# EasyEDA Pro project PathFinder (1).eprj

# Schematic Schematic1
Board Name: Board1; Create Date: 2026-07-12; Page Name: P1; Project Name: PathFinder; Schematic Name: Schematic1; Update Date: 2026-07-12; Company: EasyEDA.com; Page Size: A4; Version: V1.0
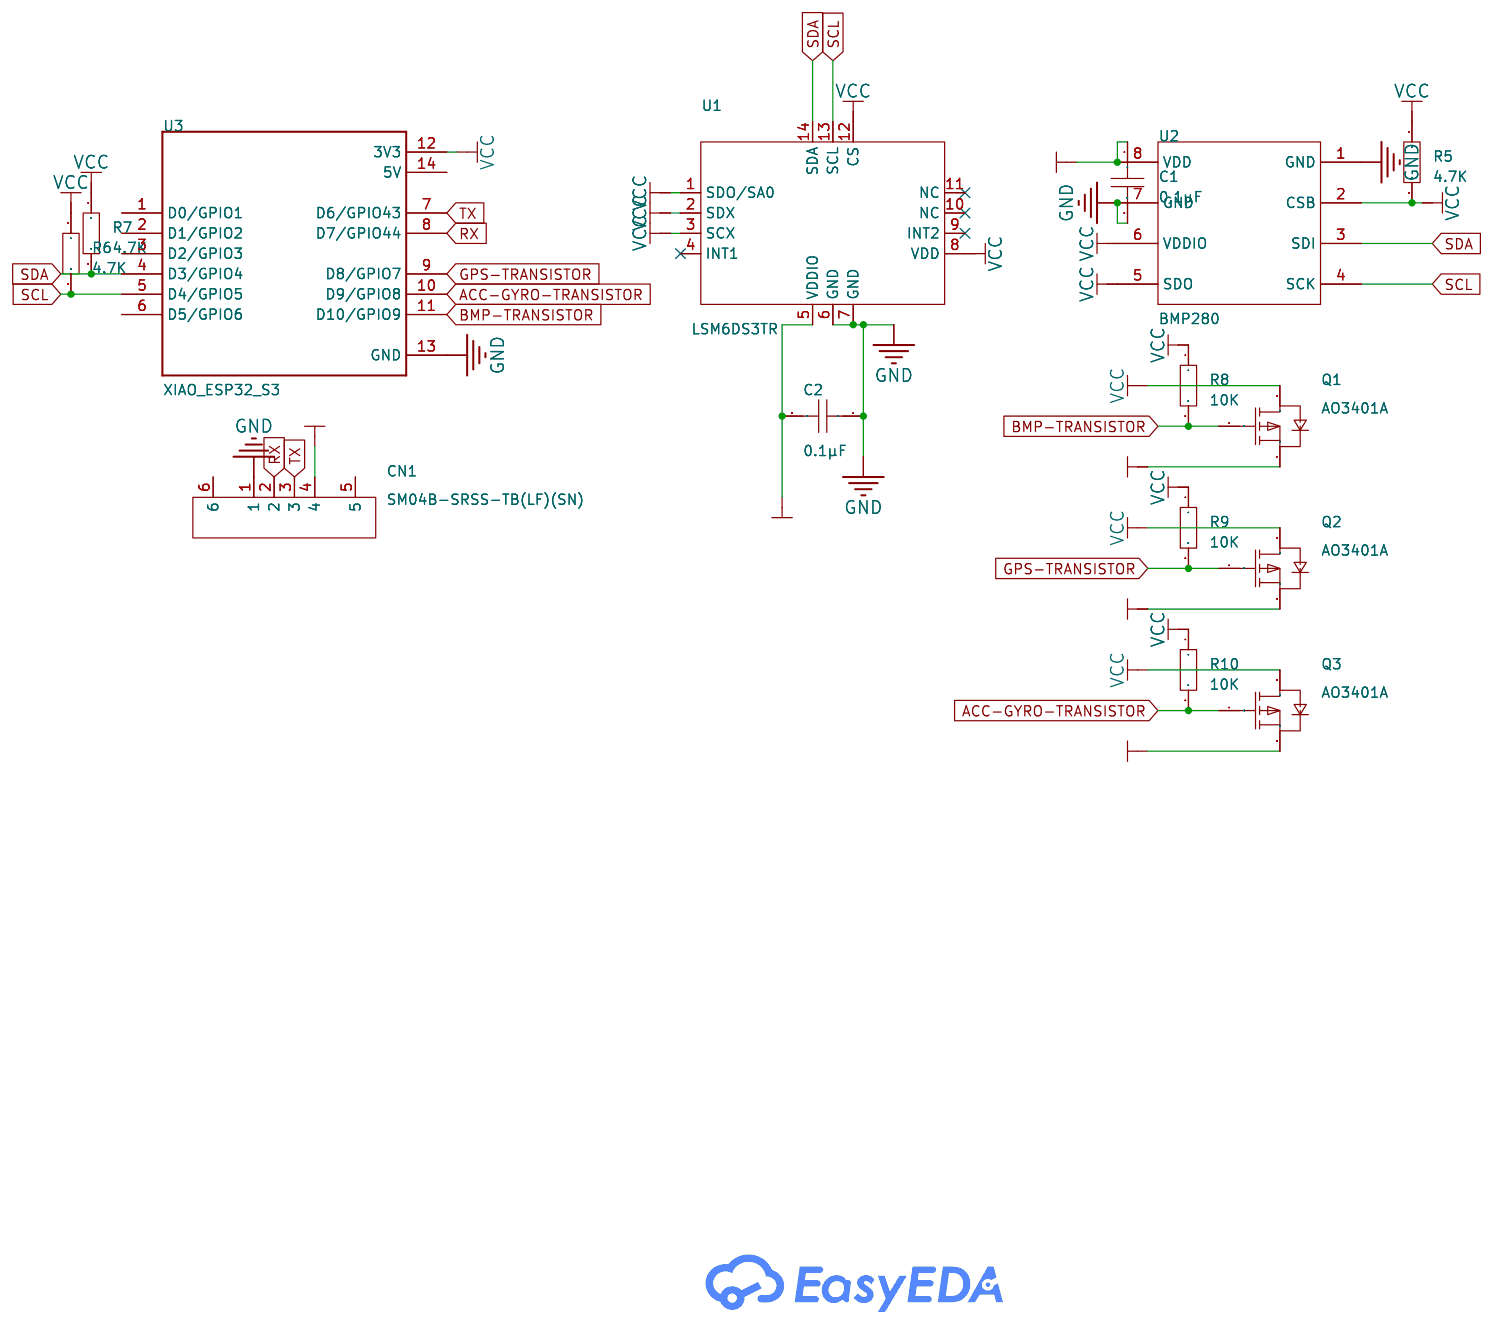
[diagram p0: schematic sheet]

## Parts
C1  100nF  [C0603]
C2  100nF  [C0603]
CN1  SM04B-SRSS-TB(LF)(SN)  [CONN-SMD_4P-P1.00_SM04B-SRSS-TB-LF-SN]
Q1  AO3401A  [SOT-23-3_L2.9-W1.3-P1.90-LS2.4-BR]
Q2  AO3401A  [SOT-23-3_L2.9-W1.3-P1.90-LS2.4-BR]
Q3  AO3401A  [SOT-23-3_L2.9-W1.3-P1.90-LS2.4-BR]
R5  10K  [R0603]
R6  10K  [R0603]
R7  10K  [R0603]
R8  10K  [R0603]
R9  10K  [R0603]
R10  10K  [R0603]
U1  LSM6DS3TR  [LGA-14_L3.0-W2.5-P0.50-TL]
U2  BMP280  [LGA-8_L2.5-W2.0-P0.65_AMP6127]
U3  XIAO_ESP32_S3  [MODULE_XIAO_ESP32_S3]

## Library data of the parts
C1 C2 = CAP_0603: Supplier Footprint: 0603
CN1 = SM04B-SRSS-TB(LF)(SN): LCSC Part Name: 1x4P 间距:1mm 卧贴 系列:SH; Supplier Part: C160404; Manufacturer: JST; Supplier Footprint: SMD,P=1mm,卧贴; JLCPCB Part Class: Extended Part; Datasheet: https://item.szlcsc.com/datasheet/SM04B-SRSS-TB(LF)(SN)/171784.html; Supplier: LCSC; Pins Structure: 1x4P; Pitch: 1mm; Mounting Type: Surface Mount, Right Angle; Reference Series: SH; Number of Pins: 4P; Number of Rows: 1; Number of PINs Per Row: 4; Current Rating: 1A; Contact Material: Copper alloy; Contact Plating: Tin; Operating Temperature: -25℃~+85℃; Voltage Rating: 50V; Plastic Material: PA; Flame Retardant Rating: UL94V-0; Supplementary Features: Auxiliary Solder Pin; Color: White; Z-Height of the Board: 2.9mm; X-Length of Bottom Edge on Board (Spacing Line): 6mm; Y-Width of Bottom Edge on Board: 4.32mm
Q1-Q3 = AO3401A_C53477312: LCSC Part Name: P沟道高级功率MOSFET; Supplier Part: C53477312; Manufacturer: YTL(亚特联); Supplier Footprint: SOT-23; JLCPCB Part Class: Extended Part; Datasheet: https://item.szlcsc.com/datasheet/AO3401A/56654916.html; Supplier: LCSC; Number: 1 P-Channel; Drain to Source Voltage: 30V; Current - Continuous Drain(Id): 4A; RDS(on): 48mΩ@10V; Gate Threshold Voltage (Vgs(th)): 800mV; Gate Charge(Qg): 7.2nC; Input Capacitance(Ciss): 655pF; Reverse Transfer Capacitance (Crss@Vds): 53pF; Type: P-Channel; Output Capacitance(Coss): 65pF; Vgs: ±12V
R5-R10 = Res_0603: Supplier Footprint: 0603
U1 = LSM6DS3TR: LCSC Part Name: MSL=3 4.5A 双路高速功率 MOSFET 驱动器，带使能功能; Supplier Part: C95230; Manufacturer: ST(意法半导体); Supplier Footprint: LGA-14(2.5x3); JLCPCB Part Class: Extended Part; Datasheet: https://item.szlcsc.com/datasheet/LSM6DS3TR/96431.html; Supplier: LCSC; Accelerometer Sensing Axis: X,Y,Z; Acceleration Measurement Range (MAX): ±16g; Gyroscope Sensing Axis: X,Y,Z; Gyroscope Measurement Range (MAX): ±2000dps; Sensor Type: Accelerometer Gyroscope; Interface: I2C；SPI; Voltage - Supply: 1.71V~3.6V; Cache Size: 8KB; Operating Temperature: -40℃~+85℃
U2 = BMP280: LCSC Part Name: BMP280 停产; Supplier Part: C83291; Manufacturer: Bosch(博世); Supplier Footprint: LGA-8(2x2.5); JLCPCB Part Class: Extended Part; Datasheet: https://item.szlcsc.com/datasheet/BMP280/84455.html; Supplier: LCSC; Pressure range: 30Kpa~1.1bar; Voltage - Supply: 1.71V~3.6V; Standby Current: 300nA; Interface: SPI；I2C; Absolute Accuracy: 1hpa; Relative Accuracy: 0.12hpa; Features: Standby mode；Integrated ADC and digital interface；On-chip temperature output；On-chip calibration and non-volatile storage; Temperature Coefficient of Offset(TCO): 1.5pa/K; Operating Temperature: -40℃~+85℃
U3 = XIAO_ESP32_S3

## Nets
GND: C1.2 C2.1 CN1.1 U1.6(GND) U1.7(GND) U2.1(GND) U2.7(GND) U3.13(GND)
VCC: Q1.3(D) Q2.3(D) Q3.3(D) R5.1 R5.2 R6.1 R7.1 R8.1 R9.1 R10.1 U1.1(SDO/SA0) U1.2(SDX) U1.3(SCX) U1.8(VDD) U1.12(CS) U2.2(CSB) U2.5(SDO) U2.6(VDDIO) U3.12(3V3)
VCC-BMP: C1.1 Q1.2(S) U2.8(VDD)
VCC-GPS: CN1.4 Q2.2(S)
VCC-GYRO-ACC: C2.2 Q3.2(S) U1.5(VDDIO)
ACC-GYRO-TRANSISTOR: Q3.1(G) R10.2 U3.10(D9/GPIO8)
BMP-TRANSISTOR: Q1.1(G) R8.2 U3.11(D10/GPIO9)
GPS-TRANSISTOR: Q2.1(G) R9.2 U3.9(D8/GPIO7)
RX: CN1.2 U3.8(D7/GPIO44)
SCL: R6.2 U1.13(SCL) U2.4(SCK) U3.5(D4/GPIO5)
SDA: R7.2 U1.14(SDA) U2.3(SDI) U3.4(D3/GPIO4)
TX: CN1.3 U3.7(D6/GPIO43)

Not connected (* = marked no-connect by the designer): CN1 5 6; U1 4(INT1)* 9(INT2)* 10(NC)* 11(NC)*; U3 1(D0/GPIO1) 2(D1/GPIO2) 3(D2/GPIO3) 6(D5/GPIO6) 14(5V)

# Board PCB1
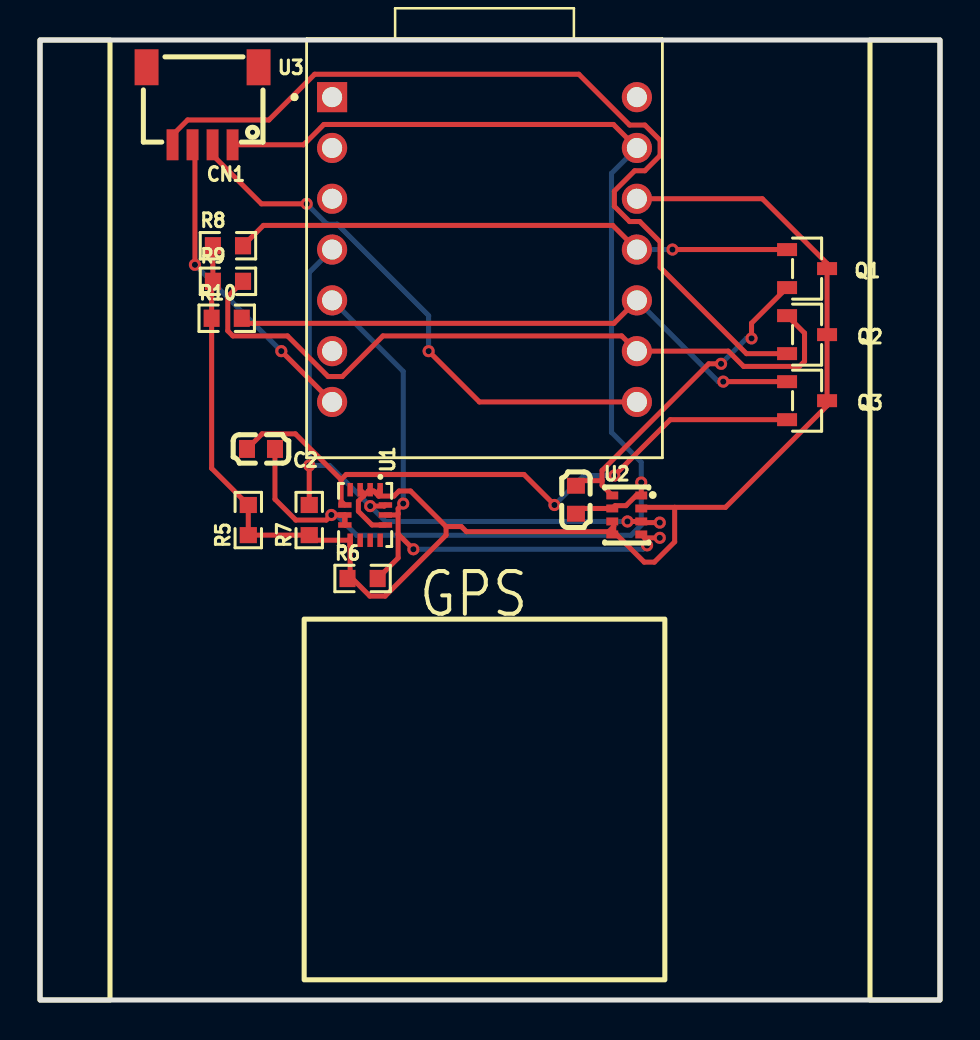
[diagram p1: board, top side]
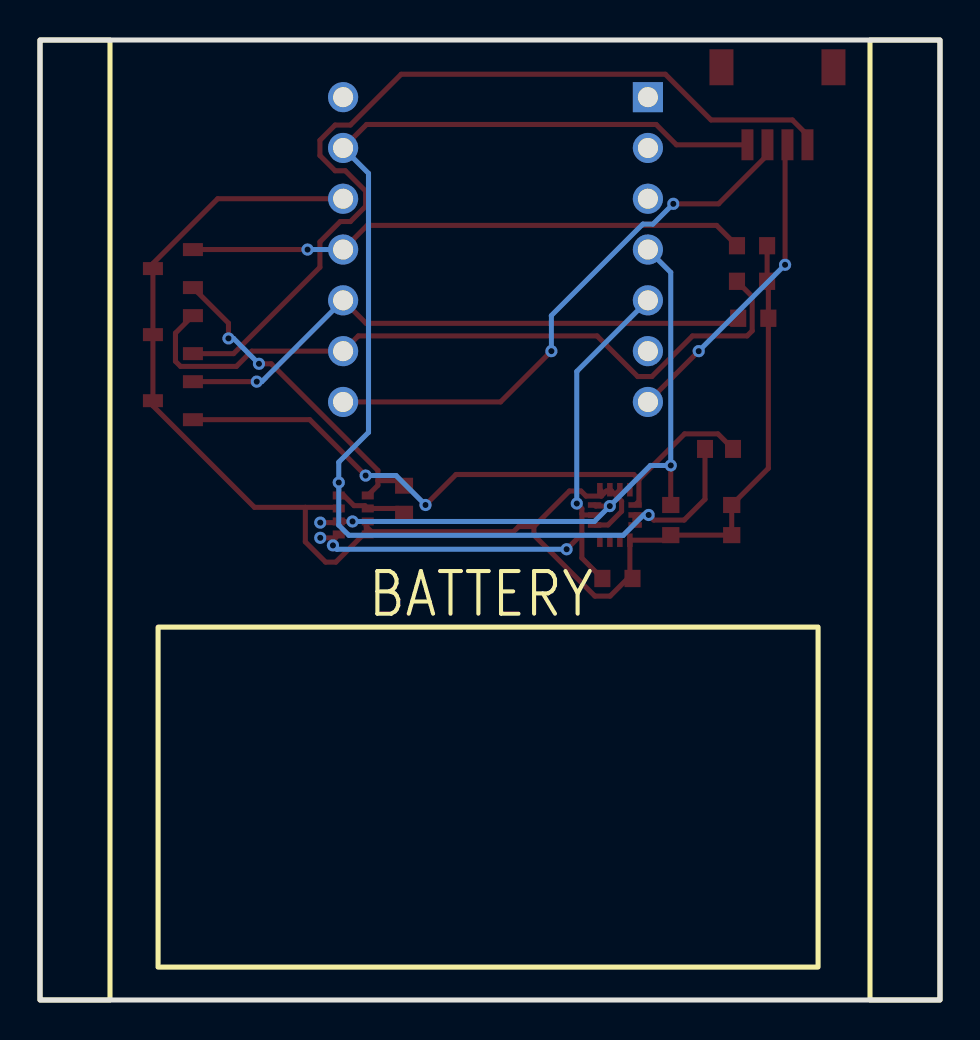
[diagram p2: board, bottom side, seen from below]

Outline 45 x 48 mm; copper layers: Top Layer, Bottom Layer. Coordinates in mm from the lower left corner of the outline.
Outline path: rectangle 0,48 45,0
Stack: Top Layer 0.035mm / Dielectric1 1.51mm FR4 er 4.5 / Bottom Layer 0.035mm

## Design rules (mm)
template: JLCPCB Capability(Two Layers Board)
spacing copperThickness1oz (default): track to track 0.102, other pairs 0.152 to 0.3
spacing copperThickness2oz: track to track 0.203, other pairs 0.152 to 0.3
track width copperThickness1oz (default): min 0.127, default 0.254, max 2.54
track width copperThickness2oz: min 0.203, default 0.254, max 2.54
differential pair differentialPair (default): width min 0.127, default 0.254, max 2.54; gap min 0.152, default 0.152
via viaSize (default): diameter min 0.5, default 0.61, max 10; hole min 0.3, default 0.305, max 6.3

## Placement (name value [footprint] x y rotation side)
C1  100nF  [C0603]  26.8 25.01 270 top
C2  100nF  [C0603]  11.05 27.55 180 top
CN1  SM04B-SRSS-TB(LF)(SN)  [CONN-SMD_4P-P1.00_SM04B-SRSS-TB-LF-SN]  8.13 44.7 180 top
Q1  AO3401A  [SOT-23-3_L2.9-W1.3-P1.90-LS2.4-BR]  38.35 36.57 180 top
Q2  AO3401A  [SOT-23-3_L2.9-W1.3-P1.90-LS2.4-BR]  38.35 33.27 180 top
Q3  AO3401A  [SOT-23-3_L2.9-W1.3-P1.90-LS2.4-BR]  38.35 29.97 180 top
R5  10K  [R0603]  10.41 24 90 top
R6  10K  [R0603]  16.13 21.08 0 top
R7  10K  [R0603]  13.46 24 90 top
R8  10K  [R0603]  9.4 37.71 0 top
R9  10K  [R0603]  9.4 35.94 0 top
R10  10K  [R0603]  9.34 34.09 0 top
U1  LSM6DS3TR  [LGA-14_L3.0-W2.5-P0.50-TL]  16.26 24.25 270 top
U2  BMP280  [LGA-8_L2.5-W2.0-P0.65_AMP6127]  29.34 24.25 0 top
U3  XIAO_ESP32_S3  [MODULE_XIAO_ESP32_S3]  22.22 37.59 0 top

## Footprints (pads in the part's own frame, mm; a bottom-side part is the same pattern mirrored in y, then rotated)
C0603
  rect 0.8x0.9 smd: 1(-0.7,0) 2(0.7,0)
CONN-SMD_4P-P1.00_SM04B-SRSS-TB-LF-SN
  rect 0.6x1.55 smd: 1(-1.5,1.938) 2(-0.5,1.938) 3(0.5,1.938) 4(1.5,1.938)
  rect 1.2x1.8 smd: 5(2.8,-1.938) 6(-2.8,-1.938)
LGA-8_L2.5-W2.0-P0.65_AMP6127
  rect 0.6x0.4 smd: 1(0.725,0.975) 2(0.725,0.325) 3(0.725,-0.325) 4(0.725,-0.975) 5(-0.725,-0.975) 6(-0.725,-0.325) 7(-0.725,0.325) 8(-0.725,0.975)
LGA-14_L3.0-W2.5-P0.50-TL
  rect 0.675x0.28 smd: 1(-1.262,0.75) 2(-1.262,0.25) 3(-1.262,-0.25) 4(-1.262,-0.75) 8(1.262,-0.75) 9(1.262,-0.25) 10(1.262,0.25) 11(1.262,0.75)
  rect 0.28x0.675 smd: 5(-0.5,-1.012) 6(0,-1.012) 7(0.5,-1.012) 12(0.5,1.012) 13(0,1.012) 14(-0.5,1.012)
MODULE_XIAO_ESP32_S3
  rect 1.508x1.508 hole 1: 1(-7.62,7.556)
  round 1.508 hole 1: 2(-7.62,5.016) 3(-7.62,2.477) 4(-7.62,-0.064) 5(-7.62,-2.603) 6(-7.62,-5.144) 7(-7.62,-7.684) 8(7.62,-7.684) 9(7.62,-5.144) 10(7.62,-2.603) 11(7.62,-0.064) 12(7.62,2.477) 13(7.62,5.016) 14(7.62,7.556)
R0603
  rect 0.806x0.864 smd: 1(-0.753,0) 2(0.753,0)
SOT-23-3_L2.9-W1.3-P1.90-LS2.4-BR
  rect 1x0.65 smd: 1(1,-0.95) 2(1,0.95) 3(-1,0)

## Nets
As in the schematic.

Pads without a net: CN1 5 6; U1 4 9 10 11; U3 1 2 3 6 14

## Via types
v1: diameter 0.61, hole 0.305, Top Layer to Bottom Layer, 20 vias

## Routing (per net, layer and track width the routed paths; a pad name or vN(x,y) marks a point on that pad's centre or on a via; arc(x,y) is an arc through that point)
GND: length 69.1
  Top Layer w0.254: U1.6 U1.7 U1.6 ; U1.6 v1(14.57,24.25) 14.31,24 12.79,24 11.75,25.04 C2.1 ; U3.13 28.67,43.78 14.19,43.78 13.18,42.76 CN1.1 ; v1(30.06,25.88) U2.1 29.81,25.23 29.3,24.72 28.75,24.72 U2.7 27.06,24.58 C1.2
  Bottom Layer w0.254: v1(14.57,24.25) 14.82,24.25 15.84,23.23 29.55,23.23 30.06,23.74 v1(30.06,25.88) 30.06,26.89 28.57,28.38 28.57,41.33 U3.13
VCC: length 82.3
  Top Layer w0.254: 20.3,23.67 21.07,23.67 21.32,23.42 28.43,23.42 28.69,23.67 ; 20.3,23.67 20.3,23.24 17.26,20.19 16.49,20.19 15.51,21.18 ; 20.3,23.67 18.53,25.45 17.95,25.45 17.7,25.2 16.94,25.2 ; 16.94,25.2 16.94,25.44 U1.1 ; 16.94,25.2 16.68,25.45 16.43,25.45 ; 28.69,23.42 30.21,21.89 30.72,21.89 31.73,22.91 31.73,24.63 ; 28.69,23.42 28.69,23.35 U2.5 ; 28.69,23.42 28.69,23.67 ; U3.12 36.12,40.06 39.35,36.82 Q1.3 Q2.3 Q3.3 39.35,29.71 34.27,24.63 31.73,24.63 ; 16.43,25.45 U1.2 ; 16.43,25.45 16.17,25.2 ; R8.1 R9.1 8.58,35.87 R10.1 8.58,26.58 R5.2 R5.1 R7.1 13.72,22.99 U1.8 15.51,21.18 ; 31.73,24.63 30.12,24.63 U2.2 ; U1.12 16.6,23.75 15.92,24.43 15.92,24.94 16.17,25.2 ; 16.17,25.2 16.17,25.35 U1.3 ; 15.51,21.18 R6.1 ; 28.69,23.67 28.69,23.85 U2.6
VCC-BMP: length 16.4
  Top Layer w0.254: 28.1,25.97 28.1,26.48 33.44,31.81 v1(34.05,31.81) ; 28.1,25.97 28.1,25.73 U2.8 ; 28.1,25.97 27.05,25.97 26.8,25.71 ; Q1.2 35.58,33.84 v1(35.58,33.08)
  Bottom Layer w0.254: v1(35.58,33.08) 35.32,33.08 v1(34.05,31.81)
VCC-GPS: length 44.5
  Top Layer w0.254: Q2.2 35.32,32.32 31,36.64 31,37.91 29.99,38.92 29.48,38.92 28.72,39.68 28.72,40.45 29.73,41.46 30.24,41.46 31,42.22 31,42.99 30.24,43.75 29.48,43.75 26.94,46.29 13.73,46.29 11.45,44 7.38,44 6.62,43.24 6.62,42.77 CN1.4
VCC-GYRO-ACC: length 32.1
  Top Layer w0.254: 15.05,26.02 15.05,24.94 U1.5 ; 15.05,26.02 12.77,28.31 11.1,28.31 C2.2 ; 15.05,26.02 15.31,26.28 24.2,26.28 v1(25.72,24.75) ; v1(28.72,26.22) 31.51,29.02 Q3.2
  Bottom Layer w0.254: v1(25.72,24.75) 27.19,26.22 v1(28.72,26.22)
ACC-GYRO-TRANSISTOR: length 29.5
  Top Layer w0.254: v1(34.16,30.92) 37.35,30.92 ; U3.10 28.7,33.83 10.34,33.83 R10.2
  Bottom Layer w0.254: U3.10 33.91,30.92 v1(34.16,30.92)
BMP-TRANSISTOR: length 28.1
  Top Layer w0.254: v1(31.62,37.52) 37.35,37.52 ; R8.2 11.17,38.73 28.64,38.73 U3.11
  Bottom Layer w0.254: U3.11 v1(31.62,37.52)
GPS-TRANSISTOR: length 36.8
  Top Layer w0.254: Q2.1 38.23,33.34 38.23,31.93 37.97,31.68 35.18,31.68 34.42,32.44 U3.9 29.08,33.2 17.14,33.2 15.11,31.17 14.41,31.17 12.37,33.2 9.64,33.2 9.39,33.46 9.39,35.17 R9.2
RX: length 27.9
  Top Layer w0.254: v1(19.43,32.44) 21.97,29.9 U3.8 ; CN1.2 8.63,42.25 11.07,39.81 v1(13.33,39.81)
  Bottom Layer w0.254: v1(13.33,39.81) 14.35,38.79 14.86,38.79 19.43,34.22 v1(19.43,32.44)
SCL: length 30.8
  Top Layer w0.254: 30.23,23.11 U2.4 ; 30.23,23.11 30.35,22.98 v1(30.35,22.73) ; 30.23,23.11 v1(30.99,23.11) ; 17.91,24.31 17.84,24.25 U1.13 ; 17.91,24.31 17.91,24.57 v1(18.16,24.82) ; 17.91,24.31 17.91,23.3 ; 17.91,23.3 v1(18.67,22.54) ; 17.91,23.3 17.91,22.1 R6.2
  Bottom Layer w0.254: U3.5 18.16,31.43 v1(18.16,24.82) ; v1(18.67,22.54) 30.16,22.54 v1(30.35,22.73)
SDA: length 32.7
  Top Layer w0.254: v1(30.99,23.87) 30.12,23.87 U2.3 v1(29.37,23.93) ; U1.14 17.21,24.7 v1(16.51,24.7) ; v1(13.46,26.73) R7.2
  Bottom Layer w0.254: v1(29.37,23.93) 17.28,23.93 v1(16.51,24.7) 14.48,26.73 v1(13.46,26.73) 13.46,36.38 U3.4
TX: length 15.7
  Top Layer w0.254: CN1.3 7.75,42.64 v1(7.75,36.76) ; U3.7 v1(12.06,32.44)
  Bottom Layer w0.254: v1(12.06,32.44) v1(7.75,36.76)

## Text on the board
Bottom Silkscreen Layer: BATTERY
Top Silkscreen Layer: GPS
